# Altium schematic sheet Isolation_Circuit.SchDoc
size A4
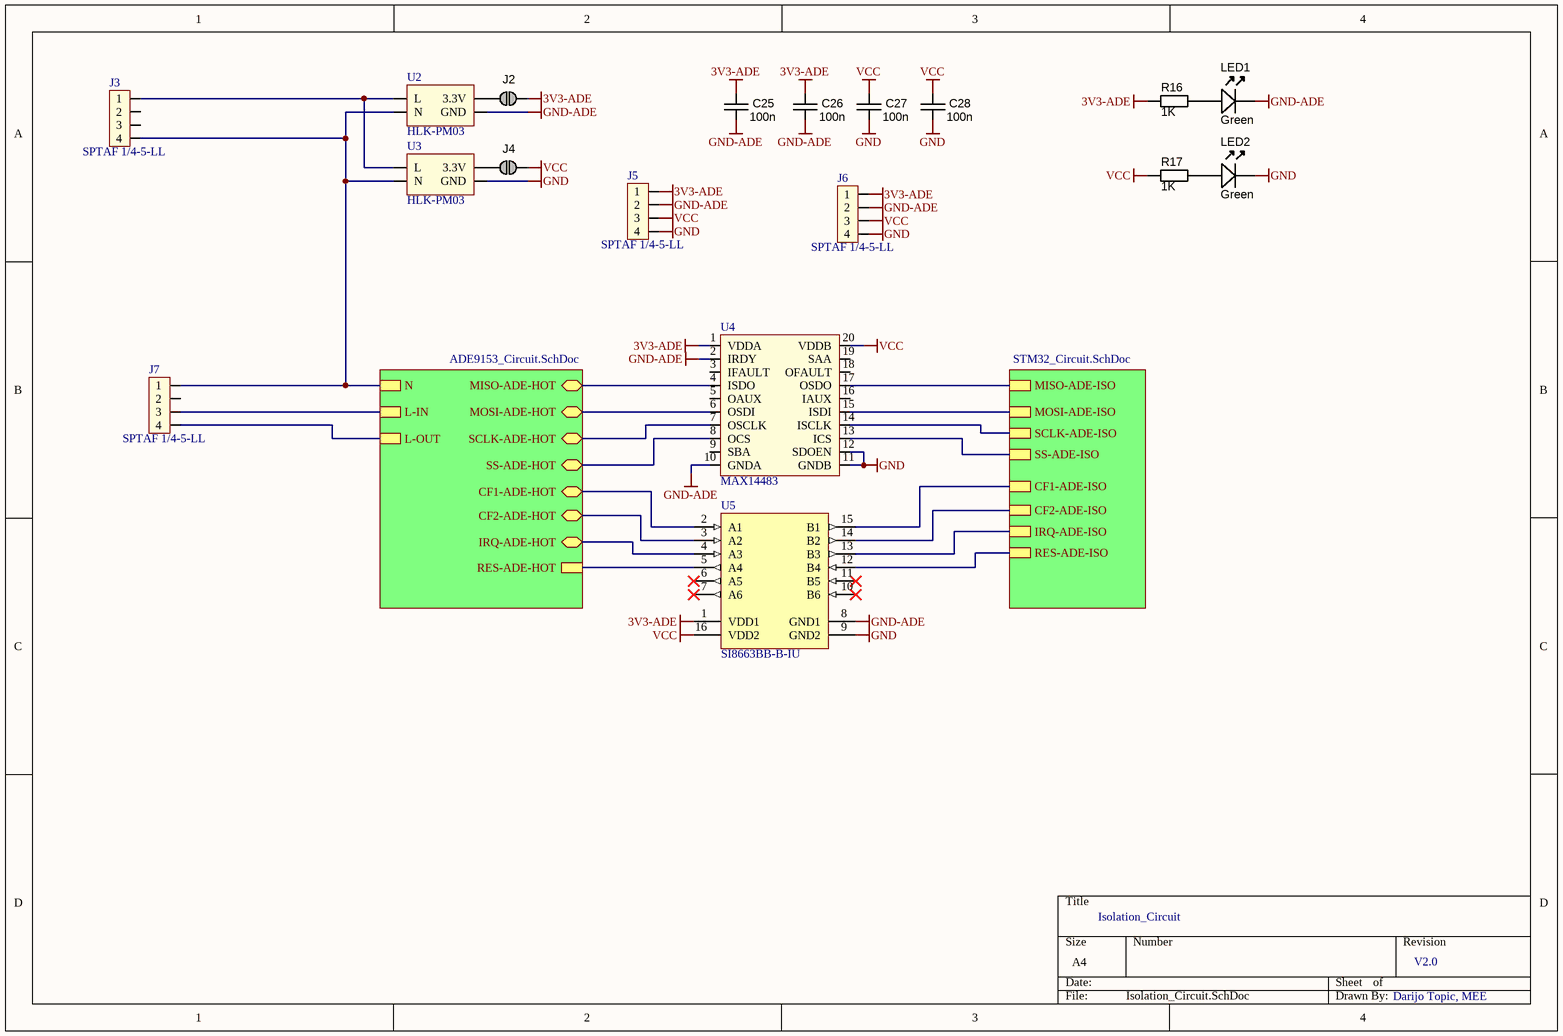
[diagram p0: Isolation_Circuit.SchDoc]

## Parts
C25  value 100n  [CAPC2012X135N]  (hidden comment: approved sub OK)
C26  value 100n  [CAPC2012X135N]  (hidden comment: approved sub OK)
C27  value 100n  [CAPC2012X135N]  (hidden comment: approved sub OK)
C28  value 100n  [CAPC2012X135N]  (hidden comment: approved sub OK)
J2  Jumper  [HDR1X2]  (value not drawn)  (no BOM)
J3  SPTAF 1/4-5-LL  [SPTAF 1/4-5-LL]
J4  Jumper  [HDR1X2]  (value not drawn)  (no BOM)
J5  SPTAF 1/4-5-LL  [SPTAF 1/4-5-LL]
J6  SPTAF 1/4-5-LL  [SPTAF 1/4-5-LL]
J7  SPTAF 1/4-5-LL  [SPTAF 1/4-5-LL]
LED1  Color: Green  [LED-0805-K]
LED2  Color: Green  [LED-0805-K]
R16  value 1K  [RESC2012X70N]  (hidden comment: Thick Film)
R17  value 1K  [RESC2012X70N]  (hidden comment: Thick Film)
U2  HLK-PM03  [HLK-PM03]
U3  HLK-PM03  [HLK-PM03]
U4  MAX14483  [SSOP20]
U5  SI8663BB-B-IU  [QSOP16]

## Sub-sheets
Designator = ADE9153_Circuit.SchDoc: CF2-ADE-HOT (bidir), IRQ-ADE-HOT (bidir), RES-ADE-HOT, MOSI-ADE-HOT (bidir), MISO-ADE-HOT (bidir), SCLK-ADE-HOT (bidir), SS-ADE-HOT (bidir), CF1-ADE-HOT (bidir), L-IN, L-OUT, N
Designator = STM32_Circuit.SchDoc: SS-ADE-ISO, MISO-ADE-ISO, CF1-ADE-ISO, CF2-ADE-ISO, IRQ-ADE-ISO, RES-ADE-ISO, MOSI-ADE-ISO, SCLK-ADE-ISO

## Nets
3V3-ADE: C25.1 C26.1 J2.1 J5.1 J6.1 R16.1 U4.1(VDDA) U5.1(VDD1)
GND: C27.2 C28.2 J5.4 J6.4 LED2.K U3.3(GND) U4.11(GNDB) U4.12(SDOEN) U5.9(GND2)
GND-ADE: C25.2 C26.2 J5.2 J6.2 LED1.K U2.3(GND) U4.2(IRDY) U4.10(GNDA) U5.8(GND1)
VCC: C27.1 C28.1 J4.1 J5.3 J6.3 R17.1 U4.20(VDDB) U5.16(VDD2)
NetJ2_2: J2.2 U2.4(3.3V)
NetJ3_1: J3.1 U2.1(L) U3.1(L)
NetJ3_4: J3.4 J7.1 U2.2(N) U3.2(N) ; sheet Designator/N
NetJ4_2: J4.2 U3.4(3.3V)
NetJ7_3: J7.3 ; sheet Designator/L-IN
NetJ7_4: J7.4 ; sheet Designator/L-OUT
NetLED1_A: LED1.A R16.2
NetLED2_A: LED2.A R17.2
NetU4_4: U4.4(ISDO) ; sheet Designator/MISO-ADE-HOT
NetU4_6: U4.6(OSDI) ; sheet Designator/MOSI-ADE-HOT
NetU4_7: U4.7(OSCLK) ; sheet Designator/SCLK-ADE-HOT
NetU4_8: U4.8(OCS) ; sheet Designator/SS-ADE-HOT
NetU4_13: U4.13(ICS) ; sheet Designator/SS-ADE-ISO
NetU4_14: U4.14(ISCLK) ; sheet Designator/SCLK-ADE-ISO
NetU4_15: U4.15(ISDI) ; sheet Designator/MOSI-ADE-ISO
NetU4_17: U4.17(OSDO) ; sheet Designator/MISO-ADE-ISO
NetU5_2: U5.2(A1) ; sheet Designator/CF1-ADE-HOT
NetU5_3: U5.3(A2) ; sheet Designator/CF2-ADE-HOT
NetU5_4: U5.4(A3) ; sheet Designator/IRQ-ADE-HOT
NetU5_5: U5.5(A4) ; sheet Designator/RES-ADE-HOT
NetU5_12: U5.12(B4) ; sheet Designator/RES-ADE-ISO
NetU5_13: U5.13(B3) ; sheet Designator/IRQ-ADE-ISO
NetU5_14: U5.14(B2) ; sheet Designator/CF2-ADE-ISO
NetU5_15: U5.15(B1) ; sheet Designator/CF1-ADE-ISO

Not connected (* = marked no-connect by the designer): J3 2 3; J7 2; U4 3(IFAULT) 5(OAUX) 9(SBA) 16(IAUX) 18(OFAULT) 19(SAA); U5 6(A5)* 7(A6)* 10(B6)* 11(B5)*

## Notes on the sheet
- Isolation_Circuit
- V2.0
- Darijo Topic, MEE

## Library data of the parts
C25-C28 = CAPC_100n_0805_X7R_50V_10%: Capacitor SMD Cer 100nF 10% 50V X7R 0805; Manufacturer 1: Kemet; Manufacturer Part Number 1: C0805C104K5RACTU; Ratings: 50V; X7R; Material: ceramic; SCDType: undef; Package / Case: 0805 (2012 metric); Tolerance: ±10%; Supplier 1: Digi-Key; Supplier Part Number 1: 399-1170-1-ND
J2 J4 = JUMP1: SMD jumper
LED1 LED2 = LED_SMD_Green_0805_6mcd: LED, 0805 SMD, Green; Manufacturer 1: LITE-ON; Manufacturer Part Number 1: LTST-C171GKT; Material: GaP; Ratings: 6 mcd; 569 nm; SCDType: source; Package / Case: 0805; Supplier 1: Digi-Key; Supplier Part Number 1: 160-1423-1-ND; Value: Green
R16 R17 = RES_1K_0805_1%: Resistor SMD chip 1k Ohm 0.125W 1% 0805; Manufacturer 1: Vishay/Dale; Manufacturer Part Number 1: CRCW08051K00FKEA; Ratings: 1/8W; SCDType: spec; Supplier 1: Digi-Key; Supplier Part Number 1: 541-1.00KCCT-ND; Package / Case: 0805 (2012 metric); Tolerance: ±1%
U2 U3 = HLK-PM03: AC 220V to DC 3.3V
U4 = MAX14483: 6-Channel, Low-Power, / 3.75kVRMS, SPI Digital Isolator; Mouser: 700-MAX14483AAP+
U5 = Si8663BC-B-IS1: Low Power Six-Channel Digital Isolator, 150 Mbps, 3.75 kVRMS Isolation Rating, -40 to 125 degC, 16-pin SOIC; Manufacturer: Silicon Labs; 10kV surge: FALSE; Channel Type: Unidirectional; Isolation Rating (kV): 3.75; Maximum Data Rate (Mbps): 150; Maximum Propagation Delay (ns): 13; Sub-Family: Isolators; DatasheetVersion: Rev. 1.4; PackageReference: SOIC-16-NB; PackageDescription: 16-Pin Small-Outline Integrated Circuit, Body 9.9 x 3.9 mm, Pitch 1.27 mm; Supplier 1: Digi-Key; Supplier Part Number 1: 336-2128-5-ND; Supplier 2: Mouser; Supplier Part Number 2: 634-SI8663BC-B-IS1; AEC-Q100: FALSE; Enable Control: FALSE; Mounting Technology: Surface Mount; Code_JEDEC: MS-012; Code_IPC: J-STD-020; PartNumber: Si8663BC-B-IS1; ComponentLink1Description: Manufacturer URL; ComponentLink1URL: http://www.silabs.com/; ComponentLink2Description: Datasheet; ComponentLink2URL: http://www.silabs.com/Support%20Documents/TechnicalDocs/Si866x.pdf; ComponentLink3Description: Package Specification; ComponentLink3URL: http://www.silabs.com/Support%20Documents/TechnicalDocs/si2401.pdf; Mouser: 634-SI8660BB-B-IU